# Altium schematic sheet USB-COM.SchDoc
size A4
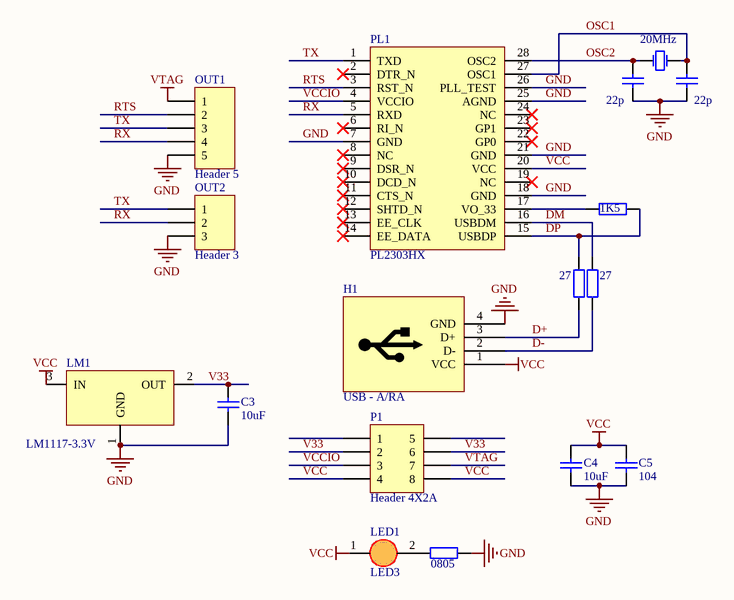
[diagram p0: USB-COM.SchDoc]

## Parts
C1  value 22p  [C0805]  (hidden comment: Capacitor Ceramic)
C2  value 22p  [C0805]  (hidden comment: Capacitor Ceramic)
C3  10uF  [C1206]
C4  10uF  [C1206]
C5  value 104  [C0805]  (hidden comment: Capacitor Ceramic)
H1  USB - A/RA  [USB-A-RA]
LED1  LED3  [LED0805]
LM1  LM1117-3.3V  [LM1117-SOP]
OUT1  Header 5  [HDR1X5]
OUT2  Header 3  [HDR1X3]
P1  Header 4X2A  [HDR2X4_CEN]
PL1  PL2303HX  [PL2303-HX]
R1  value 1K5  [DIEN TRO 0805]  (hidden comment: RES_08)
R2  value 27  [DIEN TRO 0805]  (hidden comment: RES_08)
R3  value 27  [DIEN TRO 0805]  (hidden comment: RES_08)
R4  value 0805  [DIEN TRO 0805]  (hidden comment: RES_08)
Y1  20MHz  [XTAL]

## Nets
GND: C1.1 C2.1 C3.1 C4.1 C5.1 H1.4(GND) LM1.1(GND) OUT1.5 OUT2.3 PL1.7(GND) PL1.18(GND) PL1.21(GND) PL1.25(AGND) PL1.26(PLL_TEST) R4.2
VCC: C4.2 C5.2 H1.1(VCC) LED1.1(A) LM1.3(IN) P1.4 P1.8 PL1.20(VCC)
VTAG: OUT1.1 P1.7
D+: H1.3(D+) R2.1
D-: H1.2(D-) R3.1
DM: PL1.16(USBDM) R3.2
DP: PL1.15(USBDP) R1.2 R2.2
OSC1: C2.2 PL1.27(OSC1) Y1.2(OSC2)
OSC2: C1.2 PL1.28(OSC2) Y1.1(OSC1)
RTS: OUT1.2 PL1.3(RST_N)
RX: OUT1.4 OUT2.2 PL1.5(RXD)
TX: OUT1.3 OUT2.1 PL1.1(TXD)
V33: C3.2 LM1.2(OUT) P1.2 P1.6
VCCIO: P1.3 PL1.4(VCCIO)
NetLED1_2: LED1.2(K) R4.1
NetPL1_17: PL1.17(VO_33) R1.1

Not connected (* = marked no-connect by the designer): H1 5 6; P1 1 5; PL1 2(DTR_N)* 6(RI_N)* 8(NC)* 9(DSR_N)* 10(DCD_N)* 11(CTS_N)* 12(SHTD_N)* 13(EE_CLK)* 14(EE_DATA)* 19(NC)* 22(GP0)* 23(GP1)* 24(NC)*

## Library data of the parts
C1 C2 C5 = CapSMD: Capacitor; Published: 8-Jun-2000; LatestRevisionDate: 17-Jul-2002; LatestRevisionNote: Re-released for DXP Platform.; PackageReference: RAD-0.3; Publisher: Altium Limited
C3 C4 = Cap SMD 1206
LED1 = LED 3mm
LM1 = LM1117: 800mA Low-Dropout Linear Regulator; Creator: Nguyen Ba Bien; Website: http://group3i.net
OUT1 = Header 5: Header, 5-Pin; LatestRevisionDate: 17-Jul-2002; LatestRevisionNote: Re-released for DXP Platform.; Publisher: Altium Limited
OUT2 = Header 3: Header, 3-Pin; LatestRevisionDate: 17-Jul-2002; LatestRevisionNote: Re-released for DXP Platform.; Publisher: Altium Limited
P1 = Header 4X2A: Header, 4-Pin, Dual row; LatestRevisionDate: 17-Jul-2002; LatestRevisionNote: Re-released for DXP Platform.; Publisher: Altium Limited
PL1 = PL2303HX: PL-2303 USB to RS-232 Bridge Controller; Creator: Nguyen Ba Bien; Date Created: 15/04/2010; Footprint: SSOP28/TQFP32
Y1 = XTAL: Crystal Oscillator; Published: 8-Jun-2000; LatestRevisionDate: 17-Jul-2002; LatestRevisionNote: Re-released for DXP Platform.; PackageReference: R38; Publisher: Altium Limited
R1-R4 = RES_08: Published: 8-Jun-2000; LatestRevisionDate: 17-Jul-2002; LatestRevisionNote: Re-released for DXP Platform.; PackageReference: AXIAL-0.4; Publisher: Altium Limited